# Altium schematic sheet SchemaBloc.SchDoc
size Letter; SheetNumber: 1; SheetTotal: 2
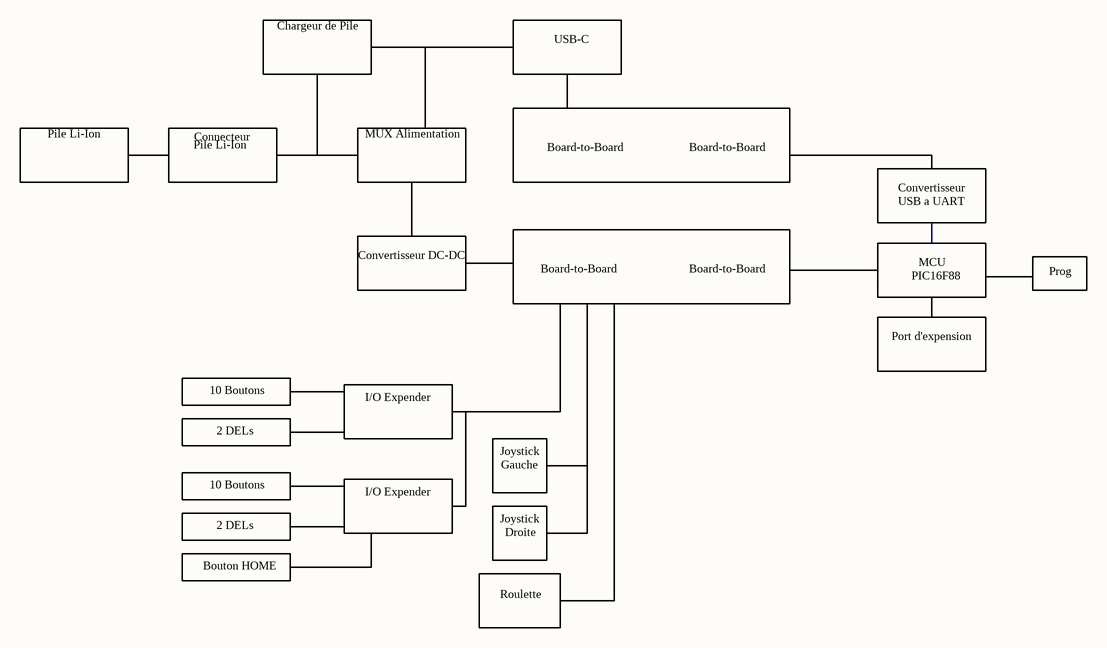
[diagram p0: SchemaBloc.SchDoc]

## Notes on the sheet
- Chargeur de Pile
- USB-C
- Pile Li-Ion
- Connecteur
- MUX Alimentation
- Board-to-Board
- Convertisseur
- USB a UART
- Convertisseur DC-DC
- MCU
- Prog
- Port d'expension
- PIC16F88
- 10 Boutons
- I/O Expender
- 2 DELs
- Joystick
- Gauche
- Droite
- Bouton HOME
- Roulette
- Titre :
- Conception :
- Date :
- Approbation :
- Heure :
- Révision :
- Feuille
- de
- Fichier :